# EAGLE schematic main_esp_board (EAGLE 9.6.2)
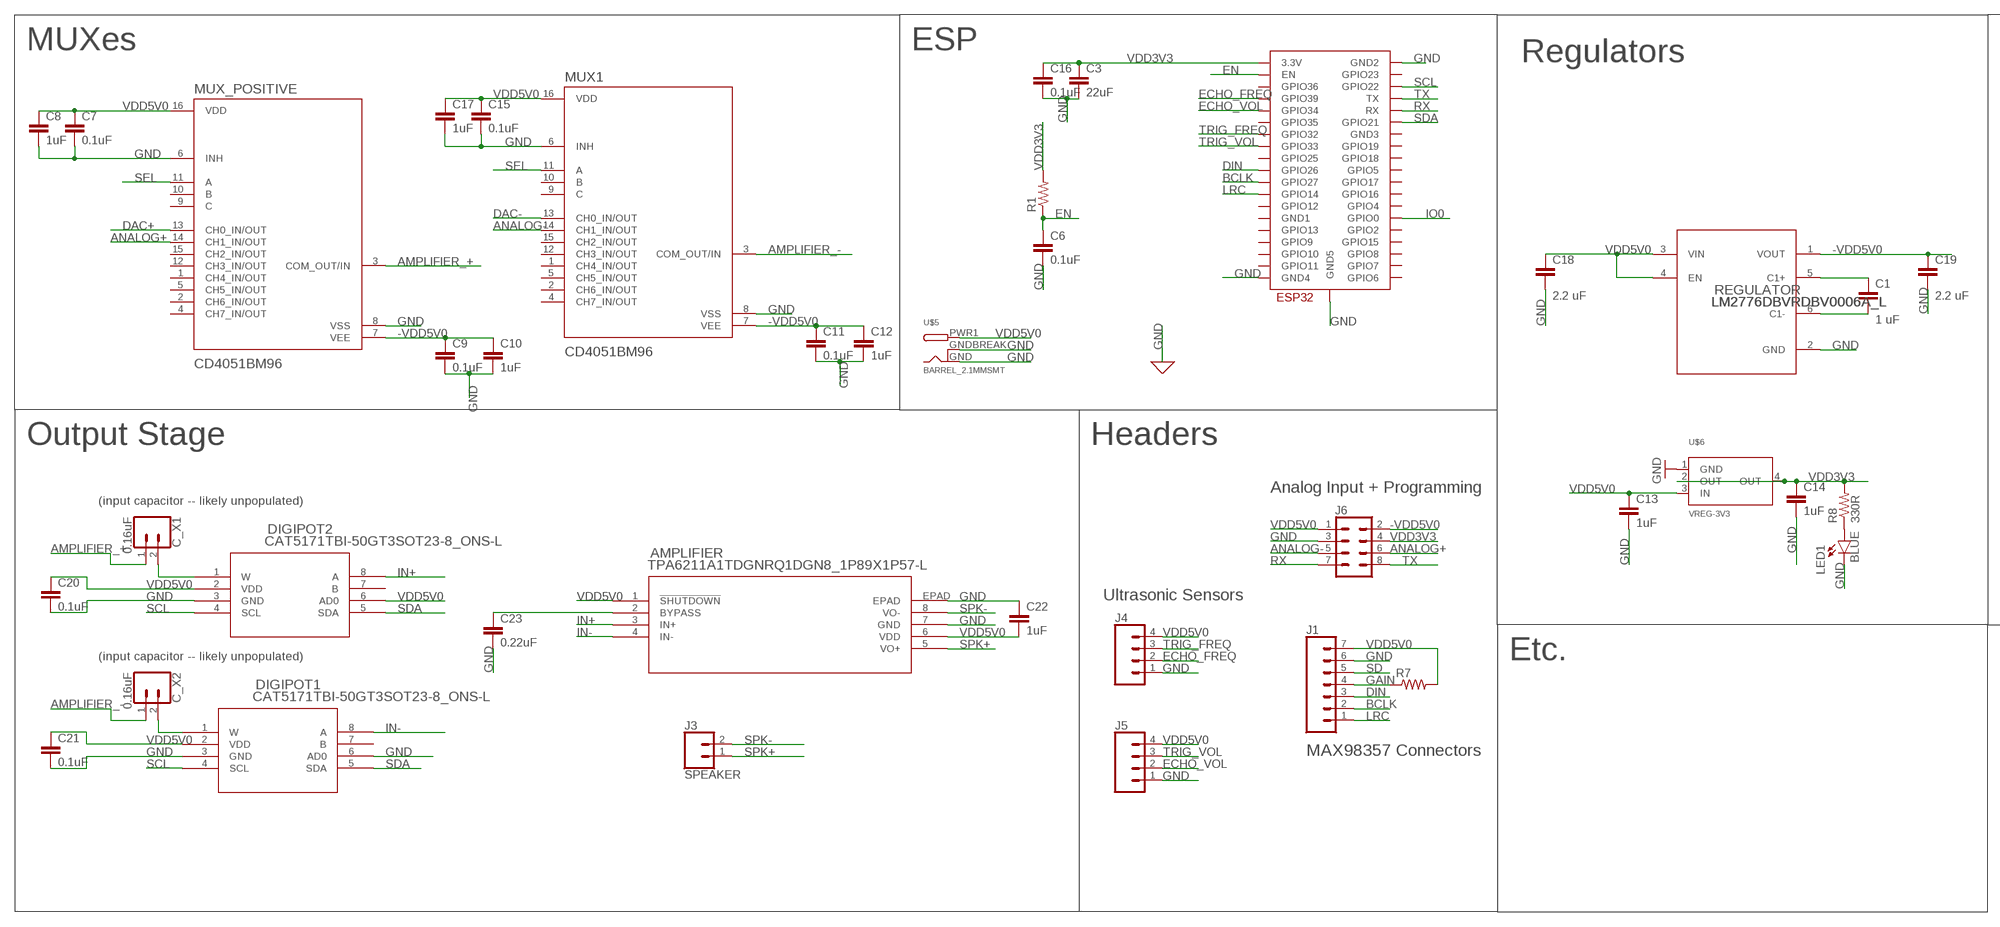
[diagram p0: schematic, sheet 1, part 1 of 2]
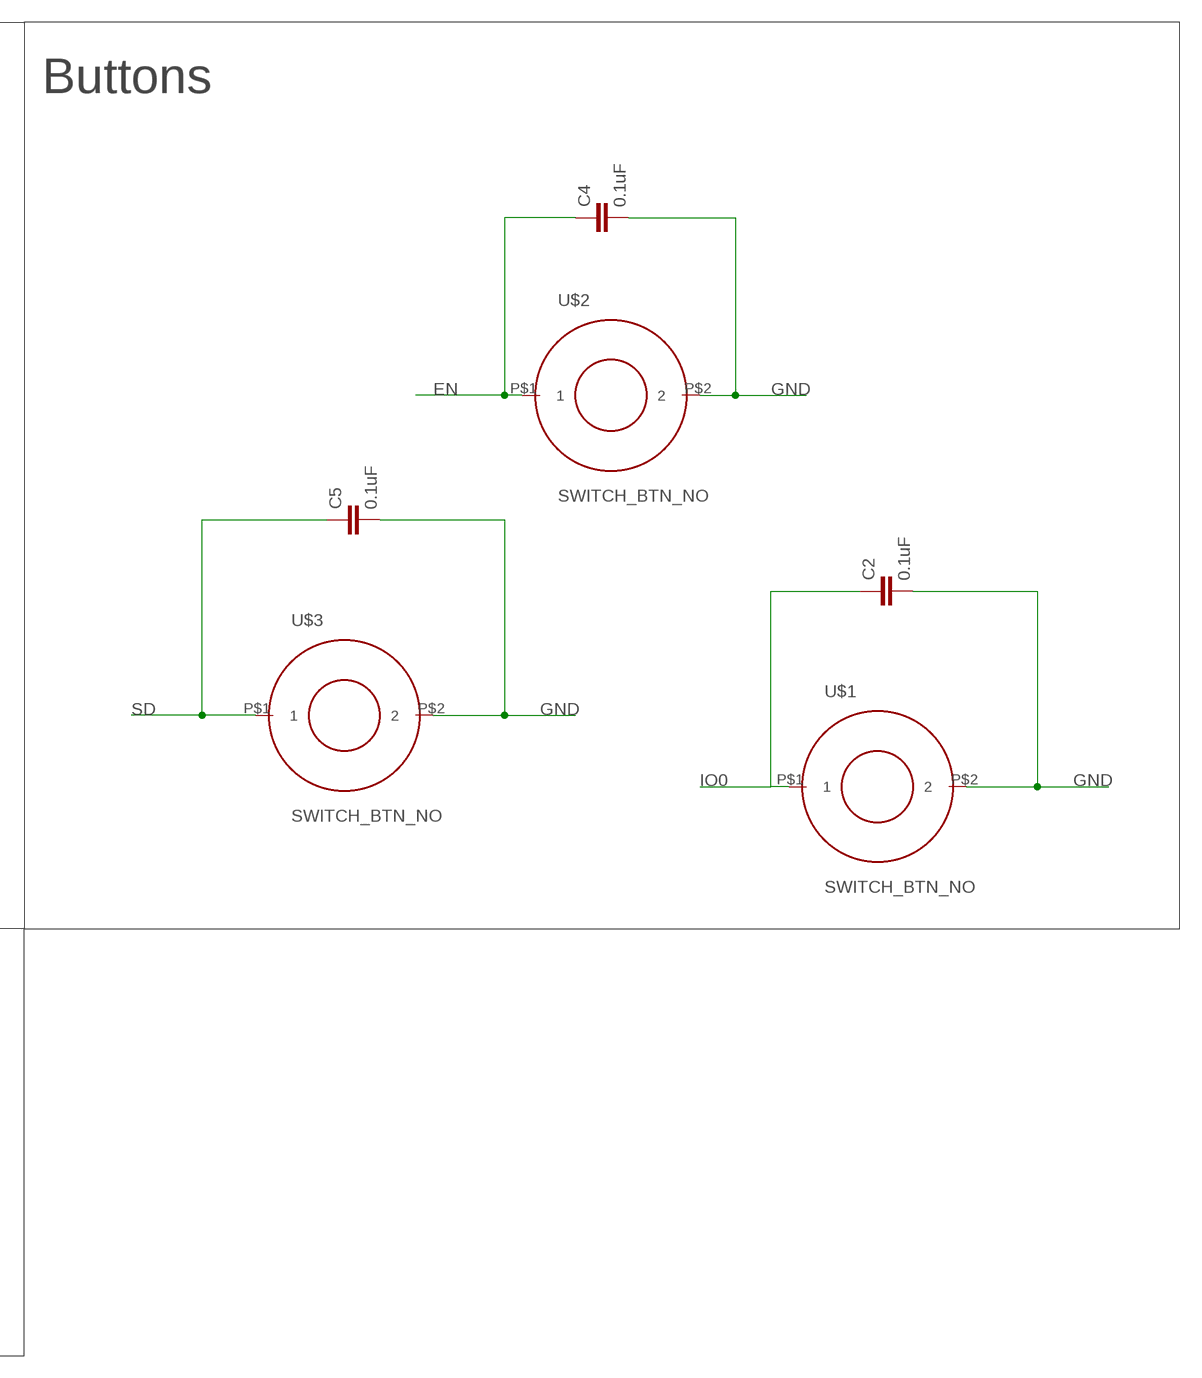
[diagram p1: schematic, sheet 1, part 2 of 2]

## Parts
AMPLIFIER  TPA6211A1TDGNRQ1DGN8_1P89X1P57-L  [DGN8_1P89X1P57-L]
C1  1 uF  CAP  [0805]
C2  0.1uF  CAP  [0805]
C3  22uF  CAP  [0805]
C4  0.1uF  CAP  [0805]
C5  0.1uF  CAP  [0805]
C6  0.1uF  CAP  [0805]
C7  0.1uF  CAP  [0805]
C8  1uF  CAP  [0805]
C9  0.1uF  CAP  [0805]
C10  1uF  CAP  [0805]
C11  0.1uF  CAP  [0805]
C12  1uF  CAP  [0805]
C13  1uF  CAP  [0805]
C14  1uF  CAP  [0805]
C15  0.1uF  CAP  [0805]
C16  0.1uF  CAP  [0805]
C17  1uF  CAP  [0805]
C18  2.2 uF  CAP  [0805]
C19  2.2 uF  CAP  [0805]
C20  0.1uF  CAP  [0805]
C21  0.1uF  CAP  [0805]
C22  1uF  CAP  [0805]
C23  0.22uF  CAP  [0805]
C_X1  0.16uF  CONN_02  [1X02]
C_X2  0.16uF  CONN_02  [1X02]
DIGIPOT1  CAT5171TBI-50GT3SOT23-8_ONS-L  [SOT23-8_ONS-L]
DIGIPOT2  CAT5171TBI-50GT3SOT23-8_ONS-L  [SOT23-8_ONS-L]
ESP32  ESP32-WROOM  [ESP32-WROOM]
J1  CONN_07  [1X07]
J3  SPEAKER  CONN_02  [1X02]
J4  CONN_04PTH  [1X04]
J5  CONN_04PTH  [1X04]
J6  CONN_04X2  [2X4]
LED1  BLUE  LED0603  [LED-0603]
MUX1  CD4051BM96  [SOIC127P600X175-16N]
MUX_POSITIVE  CD4051BM96  [SOIC127P600X175-16N]
R1  R-US_0207/10  [0207/10]
R7  R-US_0207/10  [0207/10]
R8  330R  RES  [0805]
REGULATOR  LM2776DBVRDBV0006A_L  [DBV0006A_L]
U$1  SWITCH_BTN_NO  [BTN_2]
U$2  SWITCH_BTN_NO  [BTN_2]
U$3  SWITCH_BTN_NO  [BTN_2]
U$5  BARREL_2.1MMSMT  [DCJACK_2MM_SMT]
U$6  VREG-3V3  [R-PDSO-G4_TI]

## Nets
-VDD5V0: C9.1 C10.1 C11.1 C12.1 C19.1 J6.2 MUX1.7(VEE) MUX_POSITIVE.7(VEE) REGULATOR.1(VOUT)
AMPLIFIER_+: C_X1.1 MUX_POSITIVE.3(COM_OUT/IN)
AMPLIFIER_-: C_X2.1 MUX1.3(COM_OUT/IN)
ANALOG+: J6.6 MUX_POSITIVE.14(CH1_IN/OUT)
ANALOG-: J6.5 MUX1.14(CH1_IN/OUT)
BCLK: ESP32.IO27(GPIO27) J1.2
DAC+: MUX_POSITIVE.13(CH0_IN/OUT)
DAC-: MUX1.13(CH0_IN/OUT)
DIN: ESP32.IO26(GPIO26) J1.3
ECHO_FREQ: ESP32.SENSOR_VN(GPIO39) J4.2
ECHO_VOL: ESP32.IO34(GPIO34) J5.2
EN: C4.1 C6.1 ESP32.EN R1.1 U$2.P$1
GAIN: J1.4 R7.1
GND: AMPLIFIER.7(GND) AMPLIFIER.EPAD C2.2 C3.2 C4.2 C5.2 C6.2 C7.2 C8.2 C9.2 C10.2 C11.2 C12.2 C13.2 C14.2 C15.2 C16.2 C17.2 C18.2 C19.2 C20.2 C21.2 C22.1 C23.2 DIGIPOT1.3(GND) DIGIPOT1.6(AD0) DIGIPOT2.3(GND) ESP32.GND2 ESP32.GND4 ESP32.GND5 J1.6 J4.1 J5.1 J6.3 LED1.C MUX1.6(INH) MUX1.8(VSS) MUX_POSITIVE.6(INH) MUX_POSITIVE.8(VSS) REGULATOR.2(GND) U$1.P$2 U$2.P$2 U$3.P$2 U$5.GND U$5.GNDBREAK U$6.1(GND)
IN+: AMPLIFIER.3(IN+) DIGIPOT2.8(A)
IN-: AMPLIFIER.4(IN-) DIGIPOT1.8(A)
IO0: C2.1 ESP32.IO0(GPIO0) U$1.P$1
LRC: ESP32.IO14(GPIO14) J1.1
N$1: C1.1 REGULATOR.5(C1+)
N$2: C1.2 REGULATOR.6(C1-)
N$3: AMPLIFIER.2(BYPASS) C23.1
N$6: C_X1.2 DIGIPOT2.1(W)
N$7: C_X2.2 DIGIPOT1.1(W)
N$8: LED1.A R8.1
RX: ESP32.RX J6.7
SCL: DIGIPOT1.4(SCL) DIGIPOT2.4(SCL) ESP32.IO22(GPIO22)
SD: C5.1 J1.5 U$3.P$1
SDA: DIGIPOT1.5(SDA) DIGIPOT2.5(SDA) ESP32.IO21(GPIO21)
SEL: MUX1.11(A) MUX_POSITIVE.11(A)
SPK+: AMPLIFIER.5(VO+) J3.1
SPK-: AMPLIFIER.8(VO-) J3.2
TRIG_FREQ: ESP32.IO32(GPIO32) J4.3
TRIG_VOL: ESP32.IO33(GPIO33) J5.3
TX: ESP32.TX J6.8
VDD3V3: C3.1 C14.1 C16.1 ESP32.3V3(3.3V) J6.4 R1.2 R8.2 U$6.2(OUT) U$6.4(OUT)
VDD5V0: AMPLIFIER.1(!SHUTDOWN) AMPLIFIER.6(VDD) C7.1 C8.1 C13.1 C15.1 C17.1 C18.1 C20.1 C21.1 C22.2 DIGIPOT1.2(VDD) DIGIPOT2.2(VDD) DIGIPOT2.6(AD0) J1.7 J4.4 J5.4 J6.1 MUX1.16(VDD) MUX_POSITIVE.16(VDD) R7.2 REGULATOR.3(VIN) REGULATOR.4(EN) U$5.PWR1(PWR) U$6.3(IN)
Unconnected: DIGIPOT1.7(B) DIGIPOT2.7(B) ESP32.CLK(GPIO6) ESP32.CMD(GPIO11) ESP32.GND1 ESP32.GND3 ESP32.IO2(GPIO2) ESP32.IO4(GPIO4) ESP32.IO5(GPIO5) ESP32.IO12(GPIO12) ESP32.IO13(GPIO13) ESP32.IO15(GPIO15) ESP32.IO16(GPIO16) ESP32.IO17(GPIO17) ESP32.IO18(GPIO18) ESP32.IO19(GPIO19) ESP32.IO23(GPIO23) ESP32.IO25(GPIO25) ESP32.IO35(GPIO35) ESP32.SD0(GPIO7) ESP32.SD1(GPIO8) ESP32.SD2(GPIO9) ESP32.SD3(GPIO10) ESP32.SENSOR_VP(GPIO36) MUX1.1(CH4_IN/OUT) MUX1.2(CH6_IN/OUT) MUX1.4(CH7_IN/OUT) MUX1.5(CH5_IN/OUT) MUX1.9(C) MUX1.10(B) MUX1.12(CH3_IN/OUT) MUX1.15(CH2_IN/OUT) MUX_POSITIVE.1(CH4_IN/OUT) MUX_POSITIVE.2(CH6_IN/OUT) MUX_POSITIVE.4(CH7_IN/OUT) MUX_POSITIVE.5(CH5_IN/OUT) MUX_POSITIVE.9(C) MUX_POSITIVE.10(B) MUX_POSITIVE.12(CH3_IN/OUT) MUX_POSITIVE.15(CH2_IN/OUT)

## Notes on the sheet
- MUXes | ESP
- Regulators | Buttons
- Output Stage | Headers
- Analog Input + Programming
- (input capacitor -- likely unpopulated)
- Ultrasonic Sensors
- (input capacitor -- likely unpopulated) | Etc.
- MAX98357 Connectors

## Library data of the parts
AMPLIFIER = theremin:TPA6211A1TDGNRQ1; COPYRIGHT: Copyright (C) 2025 Ultra Librarian. All rights reserved.; MANUFACTURER_PART_NUMBER: TPA6211A1TDGNRQ1; MFR_NAME: Texas Instruments
C1-C23 = Ilya_Teach:CAP
C_X1 C_X2 J3 = SparkFun-Connectors:CONN_02: Multi connection point. Often used as Generic Header-pin footprint for 0.1 inch spaced/style header connections On any of the 0.1 inch spaced packages, you can populate with these: Break Away Headers - Straight <https://www.sparkfun.com/products/116> (PRT-00116) Break Away Male Headers - Right Angle <https://www.sparkfun.com/products/553> (PRT-00553) Female Headers <https://www.sparkfun.com/products/115> (PRT-00115) Break Away Headers - Machine Pin <https://www.sparkfun.com/products/117> (PRT-00117) Break Away Female Headers - Swiss Machine Pin <https://www.sparkfun.com/products/743> (PRT-00743) For SCREWTERMINALS and SPRING TERMINALS visit here: Screw Terimnals on SparkFun.com <https://www.sparkfun.com/search/results?term=Screw+Terminals> (5mm/3.5mm/2.54mm spacing) This device is also useful as a general connection point to wire up your design to another part of your project. Our various solder wires solder well into these plated through hole pads. Hook-Up Wire - Assortment (Stranded, 22 AWG) <https://www.sparkfun.com/products/11375> (PRT-11375) Hook-Up Wire - Assortment (Solid Core, 22 AWG) <https://www.sparkfun.com/products/11367> (PRT-11367) View the entire wire category on our website here <https://www.sparkfun.com/categories/141> Special notes: Molex polarized connector foot print use with: PRT-08233 with associated crimp pins and housings. 2.54_SCREWTERM for use with PRT-10571. 3.5mm Screw Terminal footprints for PRT-08084 5mm Screw Terminal footprints for use with PRT-08432
DIGIPOT1 DIGIPOT2 = theremin:CAT5171TBI-50GT3; COPYRIGHT: Copyright (C) 2025 Ultra Librarian. All rights reserved.; MANUFACTURER_PART_NUMBER: CAT5171TBI-50GT3; MFR_NAME: onsemi
ESP32 = ESP32:ESP32-WROOM
J1 = SparkFun-Connectors:CONN_07: Multi connection point. Often used as Generic Header-pin footprint for 0.1 inch spaced/style header connections On any of the 0.1 inch spaced packages, you can populate with these: Break Away Headers - Straight <https://www.sparkfun.com/products/116> (PRT-00116) Break Away Male Headers - Right Angle <https://www.sparkfun.com/products/553> (PRT-00553) Female Headers <https://www.sparkfun.com/products/115> (PRT-00115) Break Away Headers - Machine Pin <https://www.sparkfun.com/products/117> (PRT-00117) Break Away Female Headers - Swiss Machine Pin <https://www.sparkfun.com/products/743> (PRT-00743) For SCREWTERMINALS and SPRING TERMINALS visit here: Screw Terimnals on SparkFun.com <https://www.sparkfun.com/search/results?term=Screw+Terminals> (5mm/3.5mm/2.54mm spacing) This device is also useful as a general connection point to wire up your design to another part of your project. Our various solder wires solder well into these plated through hole pads. Hook-Up Wire - Assortment (Stranded, 22 AWG) <https://www.sparkfun.com/products/11375> (PRT-11375) Hook-Up Wire - Assortment (Solid Core, 22 AWG) <https://www.sparkfun.com/products/11367> (PRT-11367) View the entire wire category on our website here <https://www.sparkfun.com/categories/141> Special notes: Molex polarized connector foot print use with SKU : PRT-08231 with associated crimp pins and housings. 1MM SMD Version SKU: PRT-10208 NOTES ON THE VARIANTS LOCK and LOCK_LONGPADS... This footprint was designed to help hold the alignment of a through-hole component (i.e. 6-pin header) while soldering it into place. You may notice that each hole has been shifted either up or down by 0.005 of an inch from it's more standard position (which is a perfectly straight line). This slight alteration caused the pins (the squares in the middle) to touch the edges of the holes. Because they are alternating, it causes a "brace" to hold the component in place. 0.005 has proven to be the perfect amount of "off-center" position when using our standard breakaway headers. Although looks a little odd when you look at the bare footprint, once you have a header in there, the alteration is very hard to notice. Also,if you push a header all the way into place, it is covered up entirely on the bottom side.
J4 J5 = SparkFun-Connectors:CONN_04: Multi connection point. Often used as Generic Header-pin footprint for 0.1 inch spaced/style header connections On any of the 0.1 inch spaced packages, you can populate with these: Break Away Headers - Straight <https://www.sparkfun.com/products/116> (PRT-00116) Break Away Male Headers - Right Angle <https://www.sparkfun.com/products/553> (PRT-00553) Female Headers <https://www.sparkfun.com/products/115> (PRT-00115) Break Away Headers - Machine Pin <https://www.sparkfun.com/products/117> (PRT-00117) Break Away Female Headers - Swiss Machine Pin <https://www.sparkfun.com/products/743> (PRT-00743) For SCREWTERMINALS and SPRING TERMINALS visit here: Screw Terimnals on SparkFun.com <https://www.sparkfun.com/search/results?term=Screw+Terminals> (5mm/3.5mm/2.54mm spacing) This device is also useful as a general connection point to wire up your design to another part of your project. Our various solder wires solder well into these plated through hole pads. Hook-Up Wire - Assortment (Stranded, 22 AWG) <https://www.sparkfun.com/products/11375> (PRT-11375) Hook-Up Wire - Assortment (Solid Core, 22 AWG) <https://www.sparkfun.com/products/11367> (PRT-11367) View the entire wire category on our website here <https://www.sparkfun.com/categories/141> Special notes: Molex polarized connector foot print use with SKU : PRT-08231 with associated crimp pins and housings. 1MM SMD Version SKU: PRT-10208; PROD_ID: CONN-09696
J6 = SparkFun-Connectors:CONN_04X2: Multi connection point. Often used as Generic Header-pin footprint for 0.1 inch spaced/style header connections On any of the 0.1 inch spaced packages, you can populate with these: Break Away Headers - Straight <https://www.sparkfun.com/products/116> (PRT-00116) Break Away Male Headers - Right Angle <https://www.sparkfun.com/products/553> (PRT-00553) Female Headers <https://www.sparkfun.com/products/115> (PRT-00115) Break Away Headers - Machine Pin <https://www.sparkfun.com/products/117> (PRT-00117) Break Away Female Headers - Swiss Machine Pin <https://www.sparkfun.com/products/743> (PRT-00743)
LED1 = Ilya_Teach:LED: LEDs Standard schematic elements and footprints for 5mm, 3mm, 1206, and 0603 sized LEDs. 5mm - Spark Fun Electronics SKU : COM-00529 (and others)
MUX1 MUX_POSITIVE = CD4051BM96:CD4051BM96; MANUFACTURER: Texas Instruments; MAXIMUM_PACKAGE_HEIGHT: 1.75mm; PARTREV: I; STANDARD: IPC-7351B
R1 R7 = rcl:R-US_: RESISTOR, American symbol; SPICEPREFIX: R
R8 = Ilya_Teach:RES
REGULATOR = theremin:LM2776DBVR; COPYRIGHT: Copyright (C) 2025 Ultra Librarian. All rights reserved.; MANUFACTURER_PART_NUMBER: LM2776DBVR; MFR_NAME: Texas Instruments; REFDES: RefDes; TYPE: TYPE
U$1-U$3 = Ilya_Teach:SWITCH_BTN_NO
U$5 = Ilya_Teach:BARREL_2.1MM
U$6 = Ilya_Teach:VREG-3V3